# EAGLE design arm_sensor (EAGLE 9.6.2)
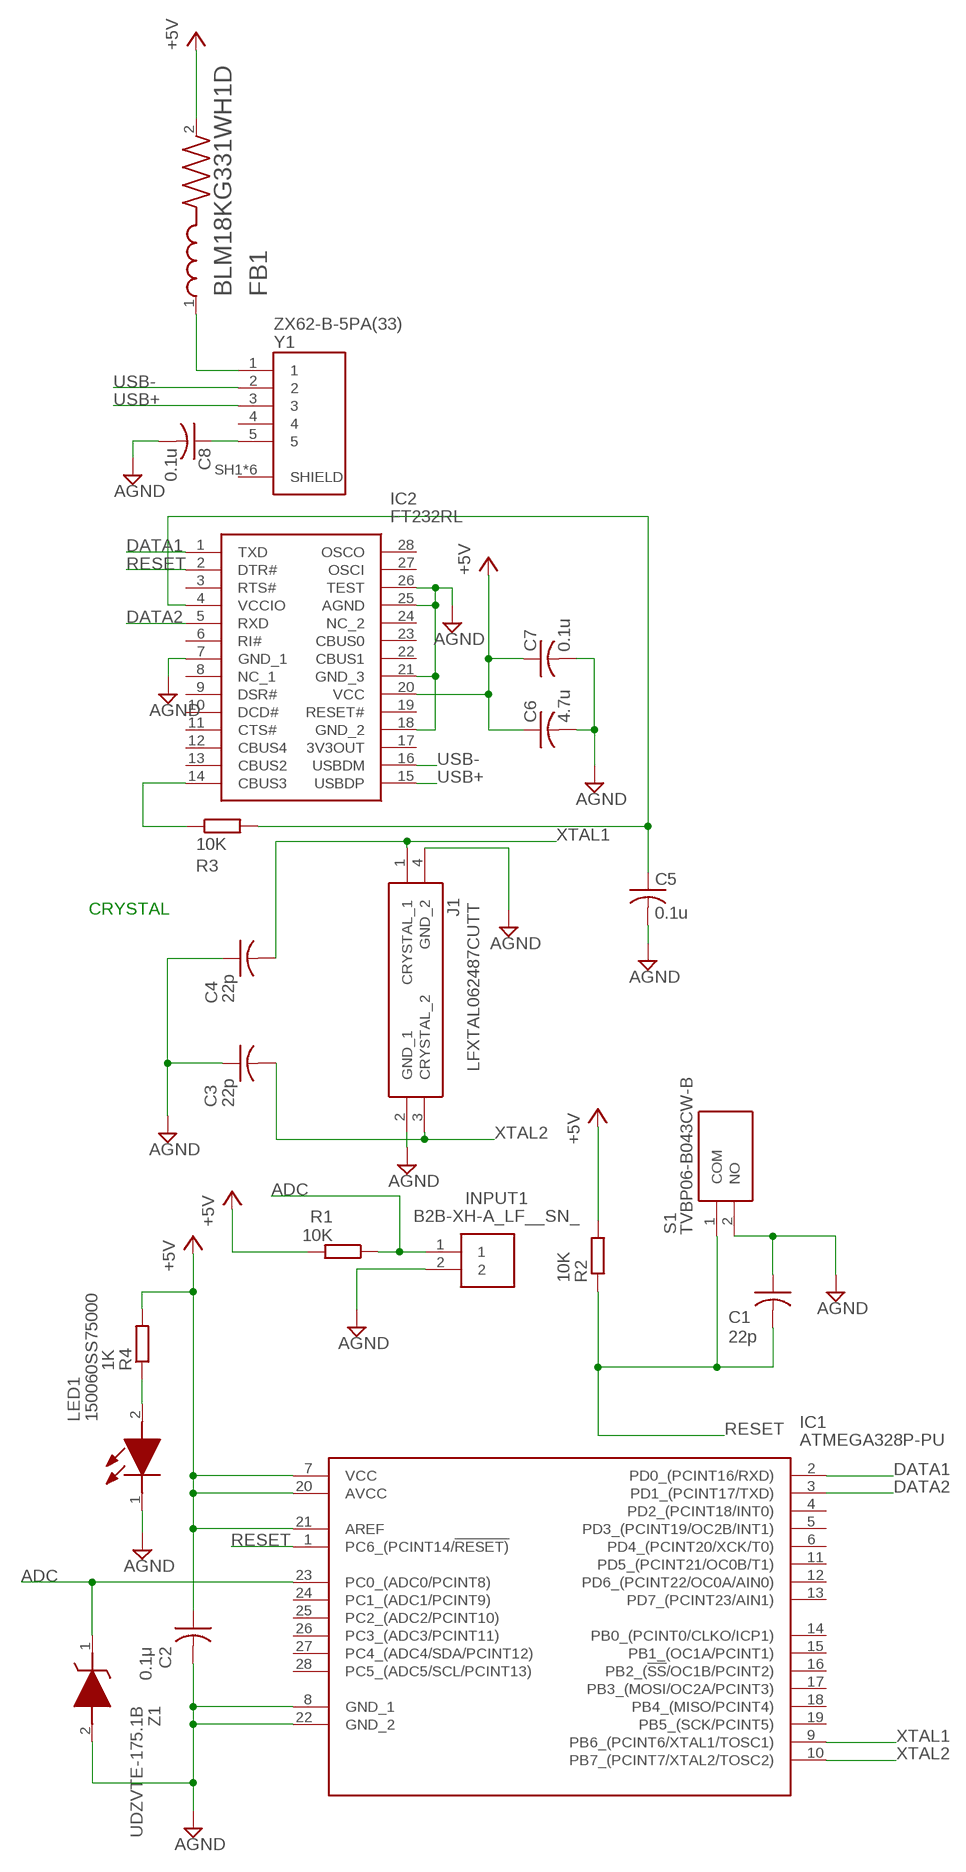
[diagram p0: schematic, sheet 1]

## Parts
C1  22p  C-USC1608  [C1608]
C2  0.1μ  C-USC1608  [C1608]
C3  22p  C-USC1608  [C1608]
C4  22p  C-USC1608  [C1608]
C5  0.1u  C-USC1608  [C1608]
C6  4.7u  C-USC1608  [C1608]
C7  0.1u  C-USC1608  [C1608]
C8  0.1u  C-USC1608  [C1608]
FB1  BLM18KG331WH1D  [BEADC1608X75N]
IC1  ATMEGA328P-PU  [DIP794W53P254L3467H457Q28N]
IC2  FT232RL  [SOP65P778X200-28N@1]
INPUT1  B2B-XH-A_LF__SN_  [SHDR2W64P0X250_1X2_740X575X700]
J1  LFXTAL062487CUTT  [LFXTAL062487CUTT]
LED1  150060SS75000  [LEDC1608X80N]
R1  10K  R-EU_R0603  [R0603]
R2  10K  R-EU_R0603  [R0603]
R3  10K  R-EU_R0603  [R0603]
R4  1K  R-EU_R0603  [R0603]
S1  TVBP06-B043CW-B  [TVBP06B043CWB]
Y1  ZX62-B-5PA(33)  [HRS_ZX62-B-5PA(33)]
Z1  UDZVTE-175.1B  [UDZVTE1751B]

## Nets
+5V [PW]: C2.1 C6.1 C7.1 FB1.2 IC1.7(VCC) IC1.20(AVCC) IC1.21(AREF) IC2.20(VCC) R1.2 R2.2 R4.2
ADC [PW]: IC1.23(PC0_(ADC0/PCINT8)) INPUT1.1 R1.1 Z1.1(K)
AGND [GND]: C1.1 C2.2 C3.1 C4.1 C5.2 C6.2 C7.2 C8.2 IC1.8(GND_1) IC1.22(GND_2) IC2.18(GND_2) IC2.21(GND_3) IC2.25(AGND) IC2.26(TEST) INPUT1.2 J1.2(GND_1) J1.4(GND_2) LED1.1(K) S1.2(NO) Z1.2(A)
DATA1: IC1.2(PD0_(PCINT16/RXD)) IC2.1(TXD)
DATA2: IC1.3(PD1_(PCINT17/TXD)) IC2.5(RXD)
N$1: LED1.2(A) R4.1
N$2: FB1.1 Y1.1
N$3: C8.1 Y1.5
N$4: IC2.14(CBUS3) R3.1
RESET: C1.2 IC1.1(PC6_(PCINT14/!RESET)) IC2.2(DTR#) R2.1 S1.1(COM)
RS485_3V3: C5.1 R3.2
USB+ [USB_SIGNAL]: IC2.15(USBDP) Y1.3
USB- [USB_SIGNAL]: IC2.16(USBDM) Y1.2
XTAL1: C4.2 IC1.9(PB6_(PCINT6/XTAL1/TOSC1)) J1.1(CRYSTAL_1)
XTAL2: C3.2 IC1.10(PB7_(PCINT7/XTAL2/TOSC2)) J1.3(CRYSTAL_2)
Unconnected: IC1.4(PD2_(PCINT18/INT0)) IC1.5(PD3_(PCINT19/OC2B/INT1)) IC1.6(PD4_(PCINT20/XCK/T0)) IC1.11(PD5_(PCINT21/OC0B/T1)) IC1.12(PD6_(PCINT22/OC0A/AIN0)) IC1.13(PD7_(PCINT23/AIN1)) IC1.14(PB0_(PCINT0/CLKO/ICP1)) IC1.15(PB1_(OC1A/PCINT1)) IC1.16(PB2_(!SS!/OC1B/PCINT2)) IC1.17(PB3_(MOSI/OC2A/PCINT3)) IC1.18(PB4_(MISO/PCINT4)) IC1.19(PB5_(SCK/PCINT5)) IC1.24(PC1_(ADC1/PCINT9)) IC1.25(PC2_(ADC2/PCINT10)) IC1.26(PC3_(ADC3/PCINT11)) IC1.27(PC4_(ADC4/SDA/PCINT12)) IC1.28(PC5_(ADC5/SCL/PCINT13)) IC2.3(RTS#) IC2.4(VCCIO) IC2.6(RI#) IC2.7(GND_1) IC2.8(NC_1) IC2.9(DSR#) IC2.10(DCD#) IC2.11(CTS#) IC2.12(CBUS4) IC2.13(CBUS2) IC2.17(3V3OUT) IC2.19(RESET#) IC2.22(CBUS1) IC2.23(CBUS0) IC2.24(NC_2) IC2.27(OSCI) IC2.28(OSCO) Y1.4 Y1.SH1(SHIELD) Y1.SH2(SHIELD) Y1.SH3(SHIELD) Y1.SH4(SHIELD) Y1.SH5(SHIELD) Y1.SH6(SHIELD)

## Notes on the sheet
- CRYSTAL

## Library data of the parts
C1-C8 = rcl:C-US: CAPACITOR, American symbol; SPICEPREFIX: C
FB1 = BLM18KG331WH1D:BLM18KG331WH1D: 100 Ohms @ 100MHz 1 Power Line Ferrite Bead 0603 (1608 Metric) 1.5A 55mOhm Check prices <https://pricing.snapeda.com/parts/BLM18KG331WH1D/Murata/view-part?ref=eda>; AVAILABILITY: In Stock; DESCRIPTION: 330 Ohms @ 100MHz 1 Power Line Ferrite Bead 0603 (1608 Metric) 1.25A 110mOhm; MF: Murata; MP: BLM18KG331WH1D; PACKAGE: 0603 Murata; PRICE: None; PURCHASE-URL: https://pricing.snapeda.com/search/part/BLM18KG331WH1D/?ref=eda
IC1 = SamacSys_Parts:ATMEGA328P-PU: MICROCHIP - ATMEGA328P-PU. - MICROCONTROLLER MCU, 8 BIT, ATMEGA, 20MHZ, DIP-28 Source: Datasheet <https://datasheet.datasheetarchive.com/originals/distributors/Datasheets_SAMA/59a954cf62ab8fb92f29cdfb51cb433a.pdf>; DESCRIPTION: MICROCHIP - ATMEGA328P-PU. - MICROCONTROLLER MCU, 8 BIT, ATMEGA, 20MHZ, DIP-28; HEIGHT: 4.572mm; MANUFACTURER_NAME: Microchip; MANUFACTURER_PART_NUMBER: ATMEGA328P-PU; MOUSER_PART_NUMBER: 556-ATMEGA328P-PU; MOUSER_PRICE-STOCK: https://www.mouser.co.uk/ProductDetail/Microchip-Technology-Atmel/ATMEGA328P-PU?qs=K8BHR703ZXguOQv3sKbWcg%3D%3D
IC2 = SamacSys_Parts:FT232RL: USB to serial TTL level UART FT232RL FT232RL, Universal Asynchronous Receiver & Transmitter 3MBd, 28-Pin, SSOP Source: Datasheet <http://www.ftdichip.com/Support/Documents/DataSheets/ICs/DS_FT232R.pdf>; DESCRIPTION: USB to serial TTL level UART FT232RL FT232RL, Universal Asynchronous Receiver & Transmitter 3MBd, 28-Pin, SSOP; HEIGHT: 2mm; MANUFACTURER_NAME: FTDI Chip; MANUFACTURER_PART_NUMBER: FT232RL
INPUT1 = SamacSys_Parts:B2B-XH-A_LF__SN_: Connector Header Through Hole 2 position 0.098" (2.50mm) Source: Datasheet <http://www.jst-mfg.com/product/pdf/eng/eXH.pdf>; DESCRIPTION: Connector Header Through Hole 2 position 0.098" (2.50mm); HEIGHT: 7mm; MANUFACTURER_NAME: JST (JAPAN SOLDERLESS TERMINALS); MANUFACTURER_PART_NUMBER: B2B-XH-A(LF)(SN)
J1 = SamacSys_Parts:LFXTAL062487CUTT: Crystals 16MHz 22pF -10C 60C Source: Datasheet <https://componentsearchengine.com/Datasheets/1/LFXTAL062487Cutt.pdf>; DESCRIPTION: Crystals 16MHz 22pF -10C 60C; HEIGHT: 0.6mm; MANUFACTURER_NAME: IQD; MANUFACTURER_PART_NUMBER: LFXTAL062487Cutt; MOUSER_PART_NUMBER: 449-LFXTAL062487CUTT; MOUSER_PRICE-STOCK: https://www.mouser.co.uk/ProductDetail/IQD/LFXTAL062487Cutt?qs=P0I6NS6hZyTSpy8xIb0Aqw%3D%3D
LED1 = SamacSys_Parts:150060SS75000: LED,Wurth Elektronik,150060SS75000 Wurth Elektronik 150060SS75000, WL-SMCW Series Red LED, 630 nm, 1608 (0603) Clear, Rectangle Lens SMD Package Source: Datasheet; DESCRIPTION: LED,Wurth Elektronik,150060SS75000 Wurth Elektronik 150060SS75000, WL-SMCW Series Red LED, 630 nm, 1608 (0603) Clear, Rectangle Lens SMD Package; HEIGHT: 0.8mm; MANUFACTURER_NAME: Wurth Elektronik; MANUFACTURER_PART_NUMBER: 150060SS75000; MOUSER_PART_NUMBER: 710-150060SS75000; MOUSER_PRICE-STOCK: https://www.mouser.co.uk/ProductDetail/Wurth-Elektronik/150060SS75000?qs=LlUlMxKIyB0oQaxwspeTEA%3D%3D
R1-R4 = rcl:R-EU_: RESISTOR, European symbol; SPICEPREFIX: R
S1 = SamacSys_Parts:TVBP06-B043CW-B: Tactile Switch Source: Datasheet <http://akizukidenshi.com/download/ds/jianfu/TVBP06-BN043CW-B.pdf>; DESCRIPTION: Tactile Switch; HEIGHT: 4.4mm; MANUFACTURER_NAME: Zhejiang Jianfu Electronics Co., Ltd; MANUFACTURER_PART_NUMBER: TVBP06-B043CW-B
Y1 = ZX62-B-5PA_33_:ZX62-B-5PA(33): ZX Series 5 Position Right Angle PCB Wire Micro B USB Plug Check prices <https://pricing.snapeda.com/parts/ZX62-B-5PA%2833%29/Hirose/view-part?ref=eda>; AVAILABILITY: In Stock; DESCRIPTION: USB - micro B USB 2.0 Receptacle Connector 5 Position Surface Mount, Right Angle; MF: Hirose; MP: ZX62-B-5PA(33); PACKAGE: None; PRICE: None; PURCHASE-URL: https://pricing.snapeda.com/search/part/ZX62-B-5PA(33)/?ref=eda
Z1 = SamacSys_Parts:UDZVTE-175.1B: Zener Diodes Diode Zener Sgl 5.09V 200mW Source: Datasheet <https://datasheet.lcsc.com/szlcsc/ROHM-Semicon-UDZVTE-175-1B_C209561.pdf>; DESCRIPTION: Zener Diodes Diode Zener Sgl 5.09V 200mW; HEIGHT: 0.9mm; MANUFACTURER_NAME: ROHM Semiconductor; MANUFACTURER_PART_NUMBER: UDZVTE-175.1B; MOUSER_PART_NUMBER: 755-UDZVTE-175.1B; MOUSER_PRICE-STOCK: https://www.mouser.co.uk/ProductDetail/ROHM-Semiconductor/UDZVTE-1751B?qs=QcFhgjUTvvrvmr%2FmWJ7Qnw%3D%3D

## Net classes
0 default: width 0.203 mm, clearance 0.152 mm
2 GND: width 0.254 mm, clearance 0.152 mm
3 PW: width 0.254 mm, clearance 0.152 mm
5 USB_SIGNAL: width 0.203 mm, clearance 0.152 mm

## Board
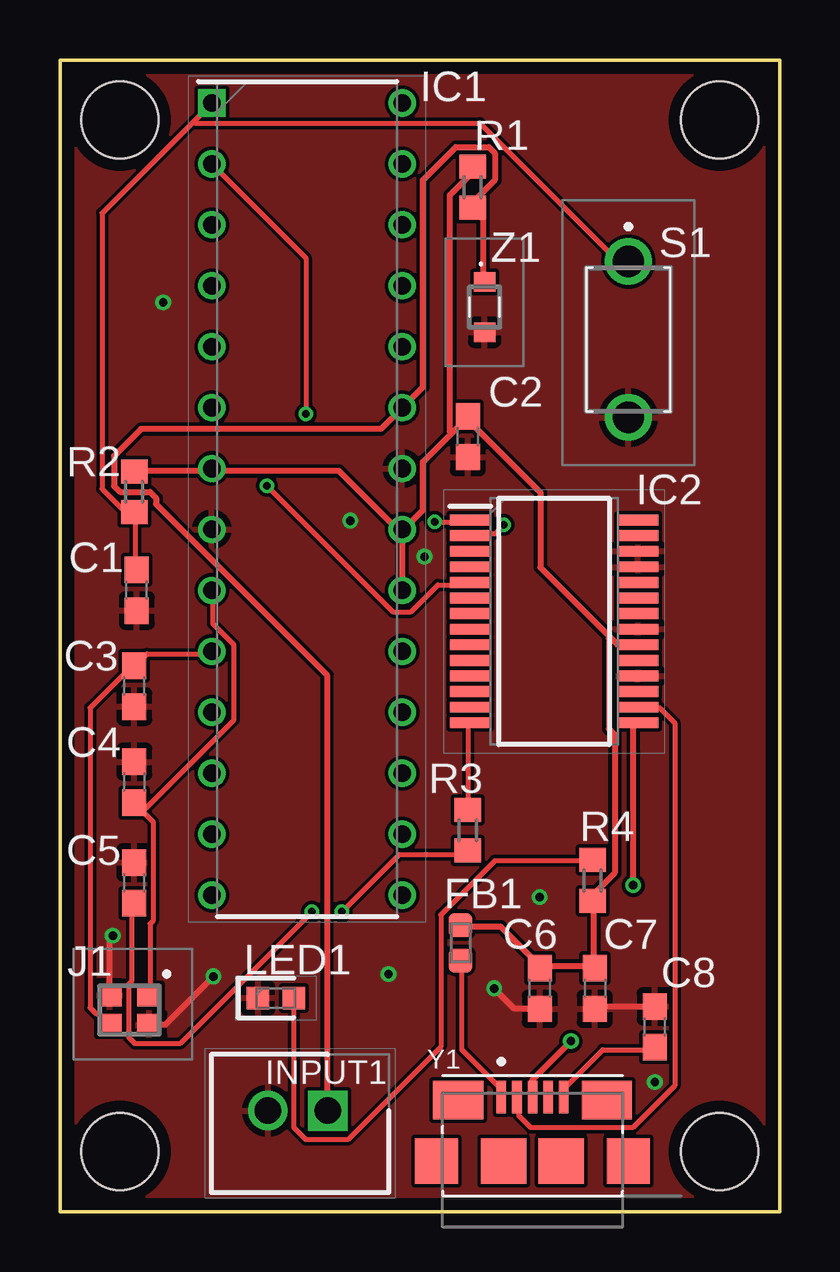
[diagram p1: board, top side]
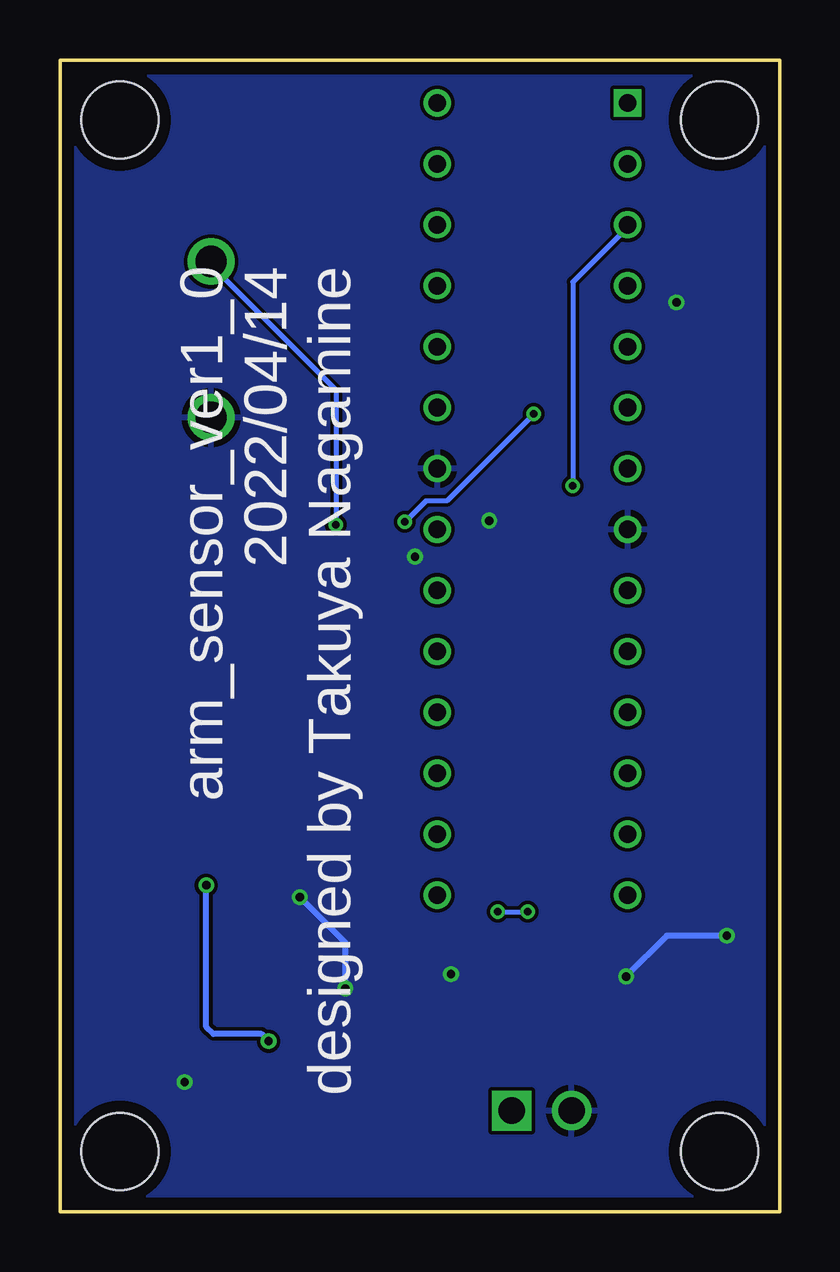
[diagram p2: board, bottom side, seen from below]

Size 30 x 48 mm. Coordinates in mm from the lower left corner, seen from the top.
Outline: 0,0 30,0 30,48 0,48 0,0
Copper layers (1*16): Top 0.035mm / dielectric 1.6mm / Bottom 0.035mm
Design rules "Elecrow_2-layer_PCB_eagle_rule *": minimum track width 6mil, minimum drill 12mil, track to track 6mil, track to pad 6mil, pad to pad 6mil, via to via 8mil, smd to smd 0mil, copper to edge 20mil, drill to drill 10mil, minimum pad ring 6mil, minimum via ring 6mil, stop-mask expansion 0mil, vias tented up to drill 100mil, thermal gap 10mil
Holes 3.2 mm at 2.5,2.5 27.5,2.5 27.5,45.5 2.5,45.5

### Footprints (pad centres in the part's own frame; a part is rotated, then mirrored left to right if it is on the bottom)
C1608 = smd 1.1 x 1: 1 -0.85,0; 2 0.85,0
BEADC1608X75N = smd 1 x 0.97: 1 -0.735,0; 2 0.735,0
DIP794W53P254L3467H457Q28N = drill 0.733 pad 1.133 square: 1 -3.969,16.51 | drill 0.733 pad 1.133: 2 -3.969,13.97; 3 -3.969,11.43; 4 -3.969,8.89; 5 -3.969,6.35; 6 -3.969,3.81; 7 -3.969,1.27; 8 -3.969,-1.27; 9 -3.969,-3.81; 10 -3.969,-6.35; 11 -3.969,-8.89; 12 -3.969,-11.43; 13 -3.969,-13.97; 14 -3.969,-16.51; 15 3.969,-16.51; 16 3.969,-13.97; 17 3.969,-11.43; 18 3.969,-8.89; 19 3.969,-6.35; 20 3.969,-3.81; 21 3.969,-1.27; 22 3.969,1.27; 23 3.969,3.81; 24 3.969,6.35; 25 3.969,8.89; 26 3.969,11.43; 27 3.969,13.97; 28 3.969,16.51
SOP65P778X200-28N@1 = smd 1.7 x 0.45: 1 -3.5,4.225; 2 -3.5,3.575; 3 -3.5,2.925; 4 -3.5,2.275; 5 -3.5,1.625; 6 -3.5,0.975; 7 -3.5,0.325; 8 -3.5,-0.325; 9 -3.5,-0.975; 10 -3.5,-1.625; 11 -3.5,-2.275; 12 -3.5,-2.925; 13 -3.5,-3.575; 14 -3.5,-4.225; 15 3.5,-4.225; 16 3.5,-3.575; 17 3.5,-2.925; 18 3.5,-2.275; 19 3.5,-1.625; 20 3.5,-0.975; 21 3.5,-0.325; 22 3.5,0.325; 23 3.5,0.975; 24 3.5,1.625; 25 3.5,2.275; 26 3.5,2.925; 27 3.5,3.575; 28 3.5,4.225
SHDR2W64P0X250_1X2_740X575X700 = drill 1.1 pad 1.65 square: 1 -1.27,0 | drill 1.1 pad 1.65: 2 1.23,0
LFXTAL062487CUTT = smd 1 x 0.9: 1 -0.825,-0.612; 2 0.825,-0.612; 3 0.825,0.613; 4 -0.825,0.613
LEDC1608X80N = smd 0.95 x 0.95: 1 -0.75,0; 2 0.75,0
R0603 = smd 1 x 1.1: 1 -0.85,0; 2 0.85,0
TVBP06B043CWB = drill 1.3 pad 1.95: 1 0,0; 2 6.5,0
HRS_ZX62-B-5PA(33) = smd 0.4 x 1.35: 1 -1.3,2.675; 2 -0.65,2.675; 3 0,2.675; 4 0.65,2.675; 5 1.3,2.675 | smd 2.1 x 1.6: SH1 -3.1,2.55; SH6 3.1,2.55 | smd 1.8 x 1.9: SH2 -4,0; SH5 4,0 | smd 1.9 x 1.9: SH3 -1.2,0; SH4 1.2,0
UDZVTE1751B = smd 0.9 x 0.8: 1 0,1.05; 2 0,-1.05

### Placement (x,y rotation side)
C1  3.2,25.9 90 top
C2  17,32.3 270 top
C3  3.1,21.9 90 top
C4  3.1,17.9 270 top
C5  3.1,13.7 90 top
C6  20,9.3 270 top
C7  22.3,9.3 270 top
C8  24.8,7.7 90 top
FB1  16.7,11.2 90 top
IC1  10.3,29.7 0 top
IC2  20.6,24.6 0 top
INPUT1  9.9,4.2 180 top
J1  2.9,8.4 180 top
LED1  9,8.9 0 top
R1  17.2,42.7 90 top
R2  3.1,30 90 top
R3  17,15.9 270 top
R4  22.2,13.8 270 top
S1  23.7,39.6 270 top
Y1  19.7,2.1 0 top
Z1  17.7,37.7 0 top

### Tracks (layer width: path | path; a pad name or v marks a point on that pad's centre or on a via)
+5V
  Top 0.254: FB1.2 16.75,11.88 18.38,11.88 20,10.25 C6.1 20.12,10.25 22.25,10.25 C7.1 22.25,10.38 22.25,12.88 R4.2 22.25,13 22.25,13.25 23.12,14.12 23.12,19.88 22.88,20.12 22.88,23.88 22.94,23.94 | R2.2 3.12,30.88 6.25,30.88 IC1.7 6.38,30.88 11.62,30.88 14.12,28.38 IC1.21 | 16.31,32.44 15.12,31.25 15.12,29.25 14.38,28.5 IC1.21 | 16.31,32.44 17,33.12 C2.1 17,33 20.02,29.98 20.02,26.85 22.94,23.94 | R1.2 17.12,43.5 17.12,43.25 16.25,42.38 16.25,32.5 16.31,32.44 | IC2.20 23.25,23.62 22.94,23.94 | IC1.20 14.25,26 14.25,28.38 IC1.21
ADC
  Top 0.254: Z1.1 17.62,38.75 17.62,41.38 17.25,41.75 R1.1 17.25,41.88 17.25,42.12 18.12,43 18.12,44.12 17.88,44.38 16.5,44.38 15.12,43 15.12,34.38 14.38,33.62 IC1.23 14.25,33.5 13.38,32.62 3.38,32.62 2.25,31.5 2.25,30.25 2.5,30 3.75,30 4,29.75 4,29.5 11.12,22.38 11.12,4.25 INPUT1.1
AGND  (via drill 0.35)
  Top 0.254: J1.2 2.08,11.38 v2.2,11.5 | v6.4,9.8 4.39,7.79 J1.4 | C7.2 22.4,8.55 C8.2 | C6.2 18.95,8.45 v18.1,9.3
  Bottom 0.254: v2.2,11.5 4.7,11.5 v6.4,9.8 | v18.1,9.3 18.1,11.2 v20,13.1
  other vias: 13.7,9.9 4.3,37.9 12.1,28.8 15.2,27.3 24.8,5.4
  pour Top: -0.5,-0.7 30.4,-0.7 30.4,48.5 -0.5,48.5
  pour Bottom: -1.7,-1.2 31.1,-1.2 31.1,49.5 -1.7,49.5
DATA1  (via drill 0.3)
  Top 0.203: v15.62,28.75 17,28.75 IC2.1 | v10.25,33.25 10.25,39.75 6.38,43.62 IC1.2
  Bottom 0.203: v15.62,28.75 14.75,29.62 13.88,29.62 v10.25,33.25
DATA2  (via drill 0.3)
  Top 0.203: v8.62,30.25 13.88,25 14.62,25 15.75,26.12 17,26.12 IC2.5
  Bottom 0.203: v8.62,30.25 8.62,38.75 6.25,41.12 IC1.3
N$1
  Top 0.203: LED1.2 9.75,3.5 10.25,3 12,3 15.88,6.88 15.88,12.38 18.12,14.62 22.12,14.62 R4.1
N$2
  Top 0.203: FB1.1 16.75,10.38 16.75,6.75 18.38,5.12 18.38,4.88 Y1.1
N$3
  Top 0.203: Y1.5 21,5.12 22.62,6.75 24.75,6.75 C8.1
N$4
  Top 0.203: R3.1 17,20.38 IC2.14
RESET  (via drill 0.3)
  Top 0.203: v18.5,28.62 18.12,28.25 17.12,28.25 IC2.2 | C1.2 3.12,26.75 3.12,29.12 R2.1 3,29.25 2.62,29.25 1.75,30.12 1.75,41.62 5.56,45.44 | 5.56,45.44 6.25,46.12 IC1.1 | S1.1 23.62,39.62 23.25,39.62 17.5,45.38 5.62,45.38 5.56,45.44
  Bottom 0.203: v18.5,28.62 18.5,34.25 23.75,39.5 S1.1
RS485_3V3  (via drill 0.3)
  Top 0.203: v10.5,12.5 5,7 3.12,7 2.88,7.25 2.88,9.5 3,9.62 3,12.75 C5.1 | v11.75,12.5 14.12,14.88 16.88,14.88 17,15 R3.2
  Bottom 0.203: v11.75,12.5 v10.5,12.5
USB+  (via drill 0.35)
  Top 0.254: Y1.3 19.7,5.5 v21.3,7.1 | v23.9,13.6 23.9,20.18 IC2.15
  Bottom 0.254: v21.3,7.1 21.6,7.4 23.6,7.4 23.9,7.7 v23.9,13.6
USB-
  Top 0.203: Y1.2 19.12,4.75 19.12,4 19.62,3.5 23.88,3.5 25.62,5.25 25.62,20.38 25,21 24.12,21 IC2.16
XTAL1
  Top 0.203: J1.1 3.75,9.12 3.75,12 3.88,12.12 3.88,16.25 3.12,17 C4.2 3.5,16.75 7.25,20.5 7.25,23.62 6.38,24.5 6.38,25.88 IC1.9
XTAL2
  Top 0.203: J1.3 2,7.88 1.62,8.25 1.5,8.25 1.25,8.5 1.25,21 3,22.75 C3.2 3.12,22.75 3.62,23.25 6.25,23.25 IC1.10

### Text on the board
bPlace: arm_sensor_ver1_0 / 2022/04/14 / designed by Takuya Nagamine